# EAGLE design Remote (EAGLE 5.11)
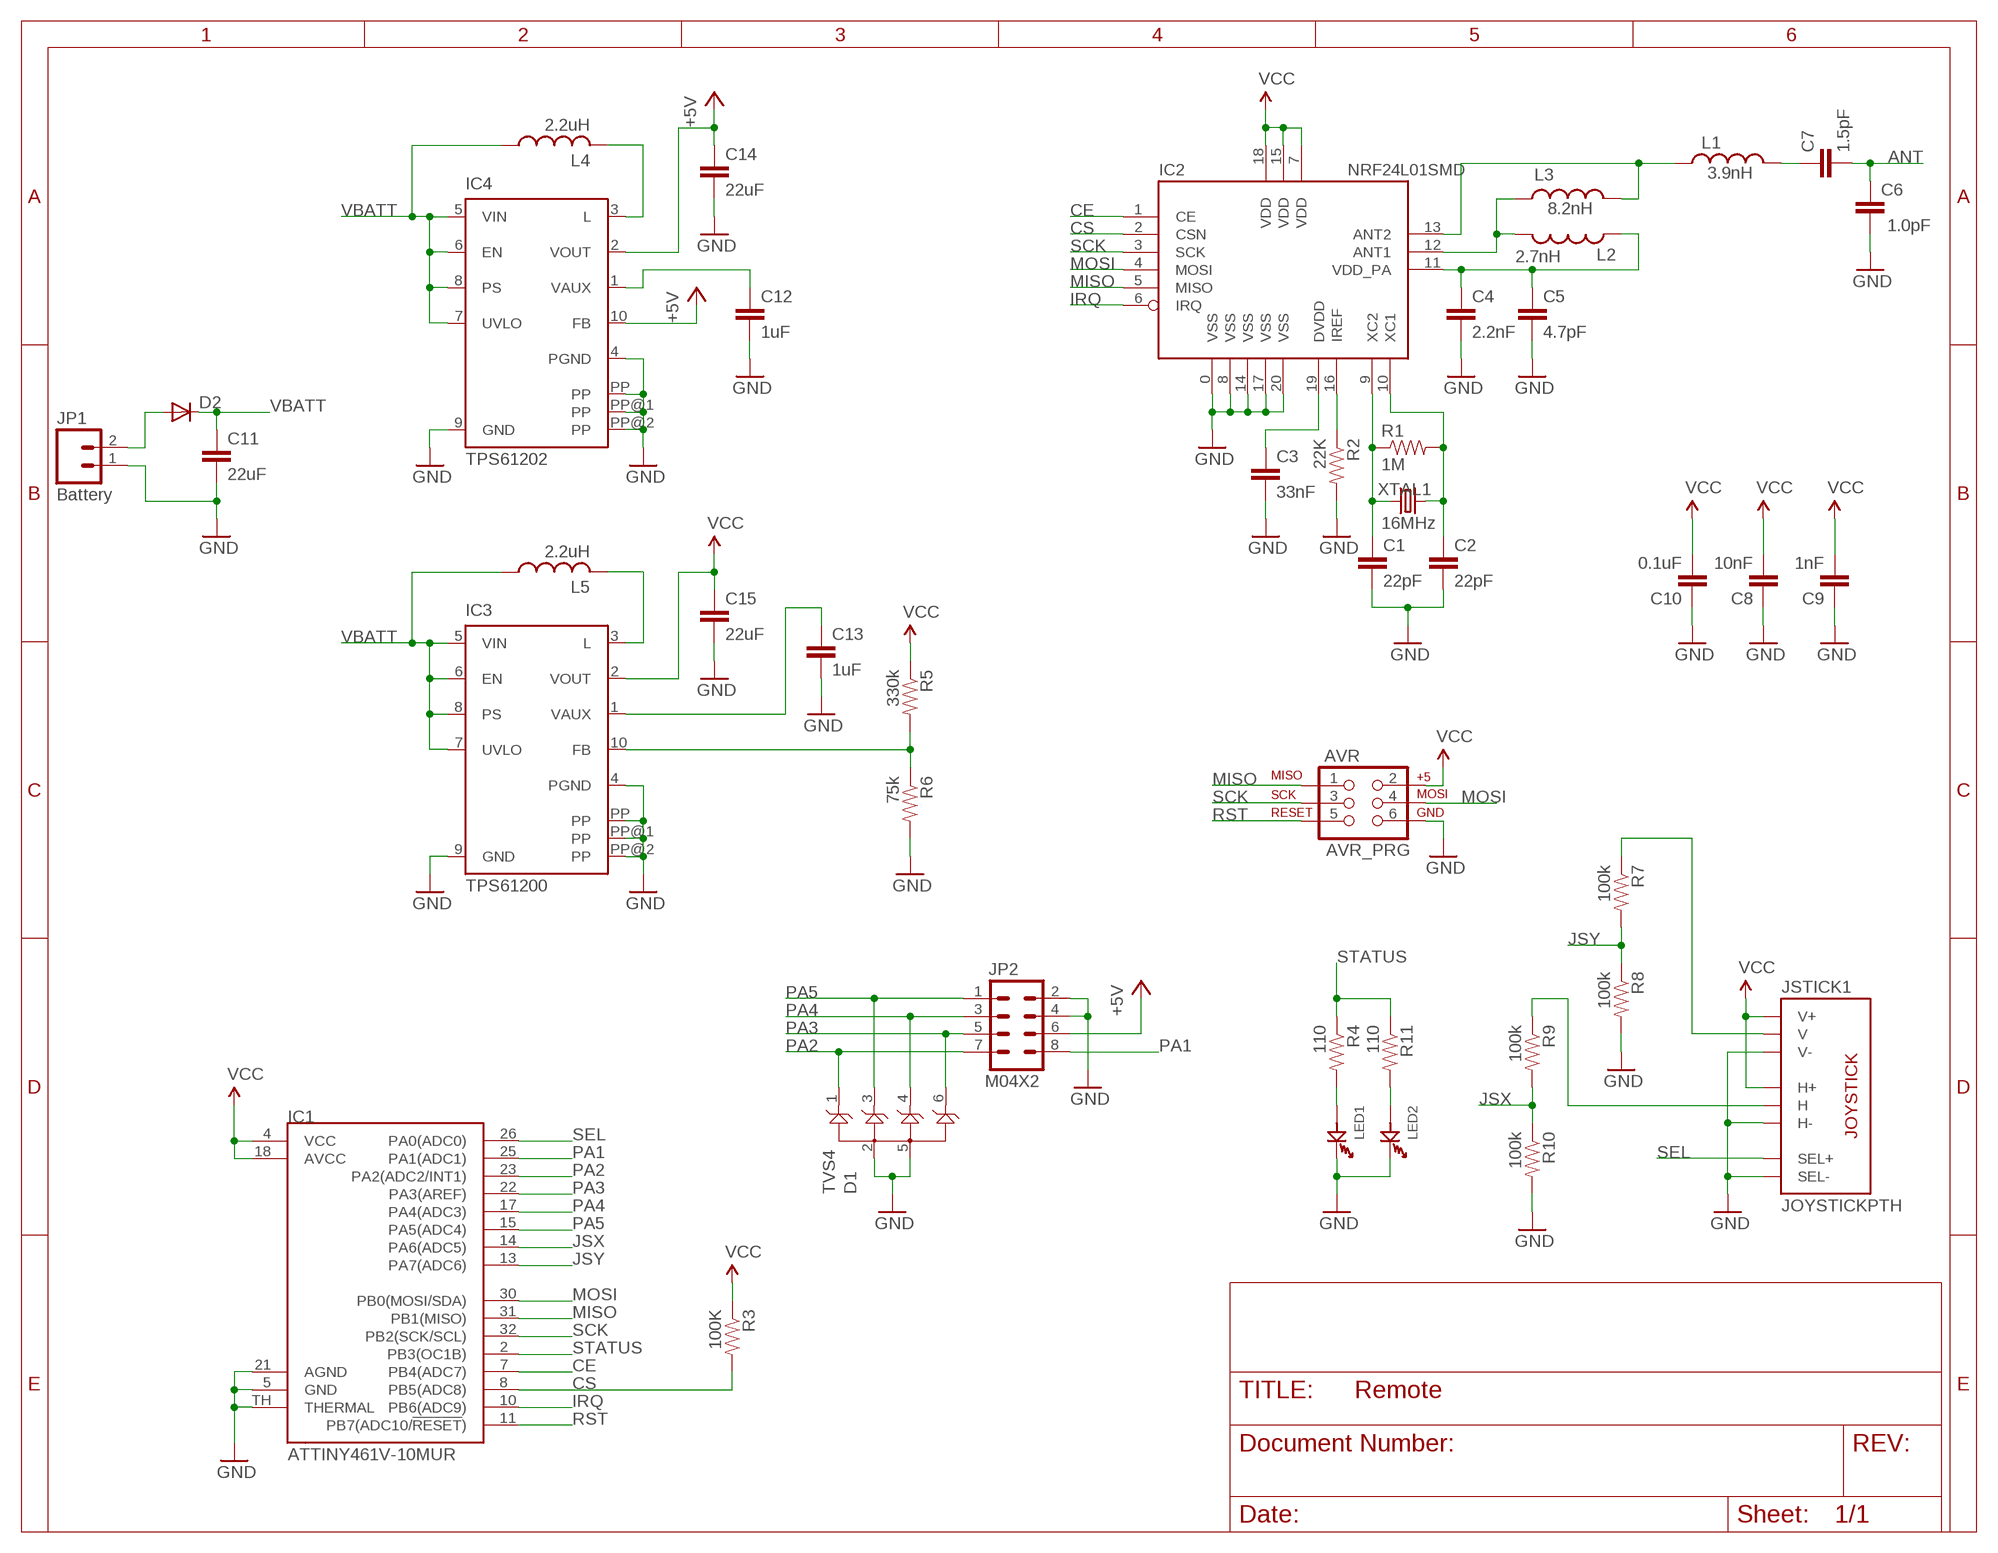
[diagram p0: schematic, sheet 1]

## Parts
AVR  AVR_PRG  AVR_SPI_PRG_6PTH  [2X3]
C1  22pF  CAP0402  [C0402]
C2  22pF  CAP0402  [C0402]
C3  33nF  CAP0402  [C0402]
C4  2.2nF  CAP0402  [C0402]
C5  4.7pF  CAP0402  [C0402]
C6  1.0pF  CAP0402  [C0402]
C7  1.5pF  CAP0402  [C0402]
C8  10nF  CAP0402  [C0402]
C9  1nF  CAP0402  [C0402]
C10  0.1uF  CAP0402  [C0402]
C11  22uF  C-EUC0603  [C0603]
C12  1uF  CAP0402  [C0402]
C13  1uF  CAP0402  [C0402]
C14  22uF  C-EUC0603  [C0603]
C15  22uF  C-EUC0603  [C0603]
D1  TVS4  [SC89]
D2  DIODE-SOD123  [SOD123]
IC1  ATTINY461V-10MUR  [MLF32-TH]
IC2  NRF24L01SMD  [QFN20]
IC3  TPS61200  [S-PDSO-N10]
IC4  TPS61202  [S-PDSO-N10]
JP1  Battery  M02PTH  [1X02]
JP2  M04X2  [2X4]
JSTICK1  JOYSTICKPTH  [JOYSTICK]
L1  3.9nH  INDUCTOR0402  [C0402]
L2  2.7nH  INDUCTOR0402  [C0402]
L3  8.2nH  INDUCTOR0402  [C0402]
L4  2.2uH  L-USL0805  [L0805]
L5  2.2uH  L-USL0805  [L0805]
LED1  CHIPLED  [0603LED]
LED2  CHIPLED  [0603LED]
R1  1M  RESISTOR0402  [C0402]
R2  22K  RESISTOR0402  [C0402]
R3  100K  RESISTOR0402  [C0402]
R4  110  RESISTOR0402  [C0402]
R5  330k  RESISTOR0402  [C0402]
R6  75k  RESISTOR0402  [C0402]
R7  100k  RESISTOR0402  [C0402]
R8  100k  RESISTOR0402  [C0402]
R9  100k  RESISTOR0402  [C0402]
R10  100k  RESISTOR0402  [C0402]
R11  110  RESISTOR0402  [C0402]
XTAL1  16MHz  CRYSTAL5X3  [CRYSTAL-SMD-5X3]

## Nets
+5V: C14.1 IC4.2(VOUT) IC4.10(FB) JP2.6
ANT: C6.2 C7.2
CE: IC1.7(PB4(ADC7)) IC2.1(CE)
CS: IC1.8(PB5(ADC8)) IC2.2(CSN) R3.2
GND: AVR.6 C1.2 C2.2 C3.2 C4.2 C5.2 C6.1 C8.1 C9.1 C10.1 C11.2 C12.2 C13.2 C14.2 C15.2 D1.2(GND) D1.5(GND) IC1.5(GND) IC1.21(AGND) IC1.TH(THERMAL) IC2.0(VSS) IC2.8(VSS) IC2.14(VSS) IC2.17(VSS) IC2.20(VSS) IC3.4(PGND) IC3.9(GND) IC3.PP IC3.PP@1(PP) IC3.PP@2(PP) IC4.4(PGND) IC4.9(GND) IC4.PP IC4.PP@1(PP) IC4.PP@2(PP) JP1.1 JP2.2 JP2.4 JSTICK1.B2A(SEL-) JSTICK1.H3(H-) JSTICK1.V3(V-) LED1.2 LED2.2 R2.2 R6.2 R8.2 R10.2
IRQ: IC1.10(PB6(ADC9)) IC2.6(IRQ)
JSX: IC1.14(PA6(ADC5)) R9.2 R10.1
JSX_HIGH: JSTICK1.H2(H) R9.1
JSY: IC1.13(PA7(ADC6)) R7.2 R8.1
JSY_HIGH: JSTICK1.V2(V) R7.1
MISO: AVR.1 IC1.31(PB1(MISO)) IC2.5(MISO)
MOSI: AVR.4 IC1.30(PB0(MOSI/SDA)) IC2.4(MOSI)
N$1: C1.1 IC2.9(XC2) R1.1 XTAL1.1
N$2: C2.1 IC2.10(XC1) R1.2 XTAL1.3
N$3: IC2.12(ANT1) L2.2 L3.1
N$4: IC2.16(IREF) R2.1
N$5: C3.1 IC2.19(DVDD)
N$6: IC2.13(ANT2) L1.1 L3.2
N$7: C4.1 C5.1 IC2.11(VDD_PA) L2.1
N$8: LED1.1 R4.2
N$9: C7.1 L1.2
N$10: IC3.3(L) L5.2
N$11: IC4.3(L) L4.2
N$12: IC3.10(FB) R5.2 R6.1
N$13: C12.1 IC4.1(VAUX)
N$14: C13.1 IC3.1(VAUX)
N$15: D2.A JP1.2
N$17: LED2.1 R11.2
PA1: IC1.25(PA1(ADC1)) JP2.8
PA2: D1.1 IC1.23(PA2(ADC2/INT1)) JP2.7
PA3: D1.6 IC1.22(PA3(AREF)) JP2.5
PA4: D1.4 IC1.17(PA4(ADC3)) JP2.3
PA5: D1.3 IC1.15(PA5(ADC4)) JP2.1
RST: AVR.5 IC1.11(PB7(ADC10/!RESET!))
SCK: AVR.3 IC1.32(PB2(SCK/SCL)) IC2.3(SCK)
SEL: IC1.26(PA0(ADC0)) JSTICK1.B1A(SEL+)
STATUS: IC1.2(PB3(OC1B)) R4.1 R11.1
VBATT: C11.1 D2.C IC3.5(VIN) IC3.6(EN) IC3.7(UVLO) IC3.8(PS) IC4.5(VIN) IC4.6(EN) IC4.7(UVLO) IC4.8(PS) L4.1 L5.1
VCC: AVR.2 C8.2 C9.2 C10.2 C15.1 IC1.4(VCC) IC1.18(AVCC) IC2.7(VDD) IC2.15(VDD) IC2.18(VDD) IC3.2(VOUT) JSTICK1.H1(H+) JSTICK1.V1(V+) R3.1 R5.1

## Library data of the parts
AVR = SparkFun:AVR_SPI_PRG_6: AVR ISP 6 Pin This is the reduced ISP connector for AVR programming. Common on Arduino. This footprint will take up less PCB space and can be used with a 10-pin to 6-pin adapter such as SKU: BOB-08508
C1-C10 C12 C13 = SparkFun:CAP: Capacitor Standard 0603 ceramic capacitor, and 0.1" leaded capacitor.
C11 C14 C15 = rcl:C-EU: CAPACITOR, European symbol
D1 = vanossj:TVS4
D2 = diode:DIODE-: DIODE
IC1 = PAS:ATTINY461V-10MUR: ATtiny26
IC2 = SparkFun:NRF24L01: 2.4GHz Low Power Transceiver This is the very popular, low cost, very low power RF transceiver from Nordic Semiconductor. Simple SPI interface. SKU: COM-00690
IC3 = texas:TPS6120*: LOW INPUT VOLTAGE SYNCHRONOUS BOOST CONVERTER WITH 1.3-A SWITCHES Source: http://focus.ti.com/lit/ds/symlink/tps61200.pdf; MPN: TPS61200DRCT; OC_FARNELL: 1471238; OC_NEWARK: 37M0066
IC4 = texas:TPS6120*: LOW INPUT VOLTAGE SYNCHRONOUS BOOST CONVERTER WITH 1.3-A SWITCHES Source: http://focus.ti.com/lit/ds/symlink/tps61200.pdf; MPN: TPS61202DRCR; OC_FARNELL: unknown; OC_NEWARK: 37M0069
JP1 = SparkFun:M02: Header 2 Standard 2-pin 0.1" header. Use with straight break away headers (SKU : PRT-00116), right angle break away headers (PRT-00553), swiss pins (PRT-00743), machine pins (PRT-00117), and female headers (PRT-00115). Molex polarized connector foot print use with SKU : PRT-08233 with associated crimp pins and housings.
JP2 = SparkFun:M04X2
JSTICK1 = SparkFun:JOYSTICK: Thumb Joystick Joystick commonly found in PS2 controllers. Two pots and a select switch. Footprint proven. Spark Fun Electronics SKU : COM-09032
L1-L3 = SparkFun:INDUCTOR: Inductors Basic Inductor/Choke - 0603 and 1206. Footprints are not proven and vary greatly between part numbers.
L4 L5 = L0805:L-US: INDUCTOR, American symbol
LED1 LED2 = PAS:CHIPLED
R1-R11 = SparkFun:RESISTOR: Resistor Basic schematic elements and footprints for 0603, 1206, and PTH 1/10th watt (small) resistors.
XTAL1 = SparkFun:CRYSTAL: Crystals Various standard crystals. Proven footprints. Spark Fun Electronics SKU : COM-00534

## Board
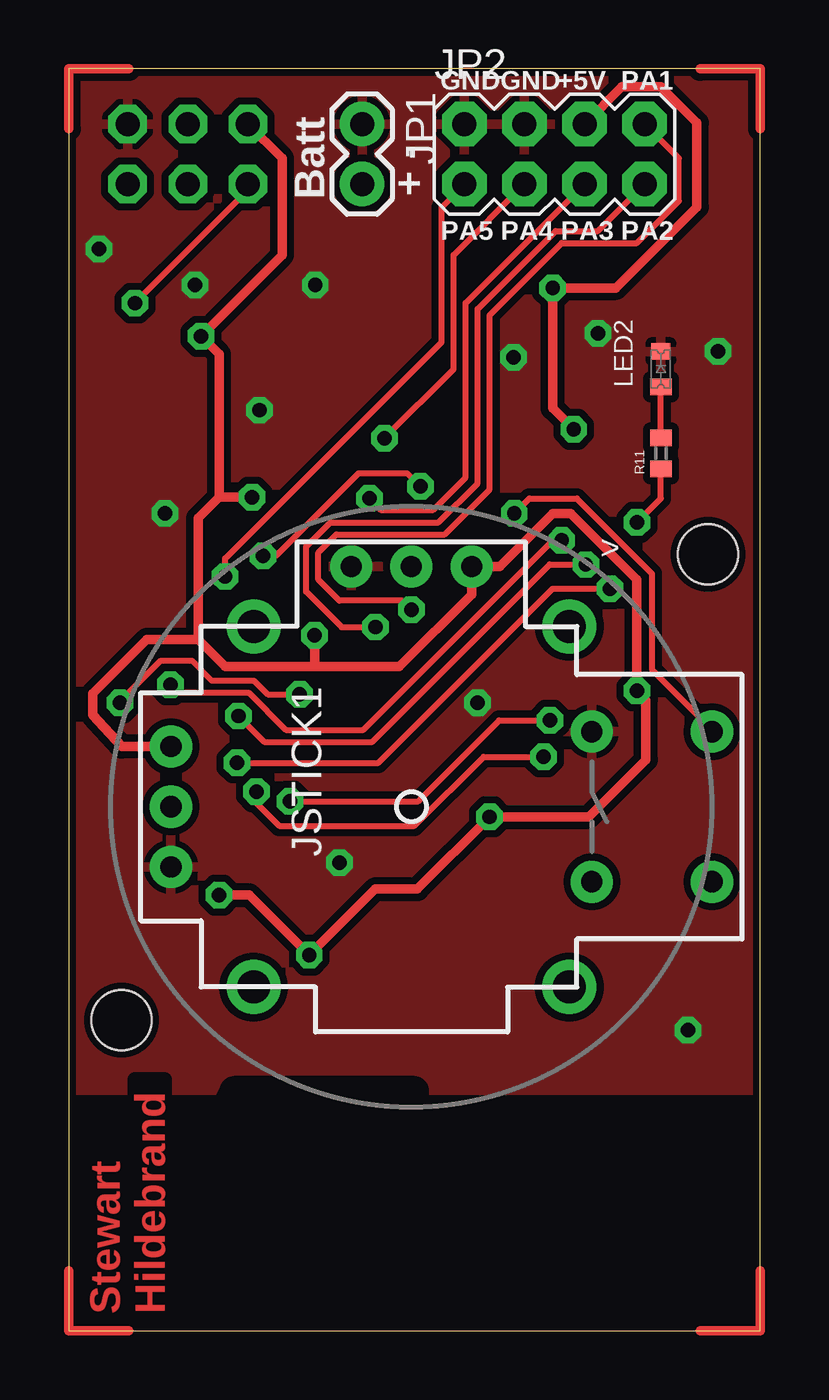
[diagram p1: board, top side]
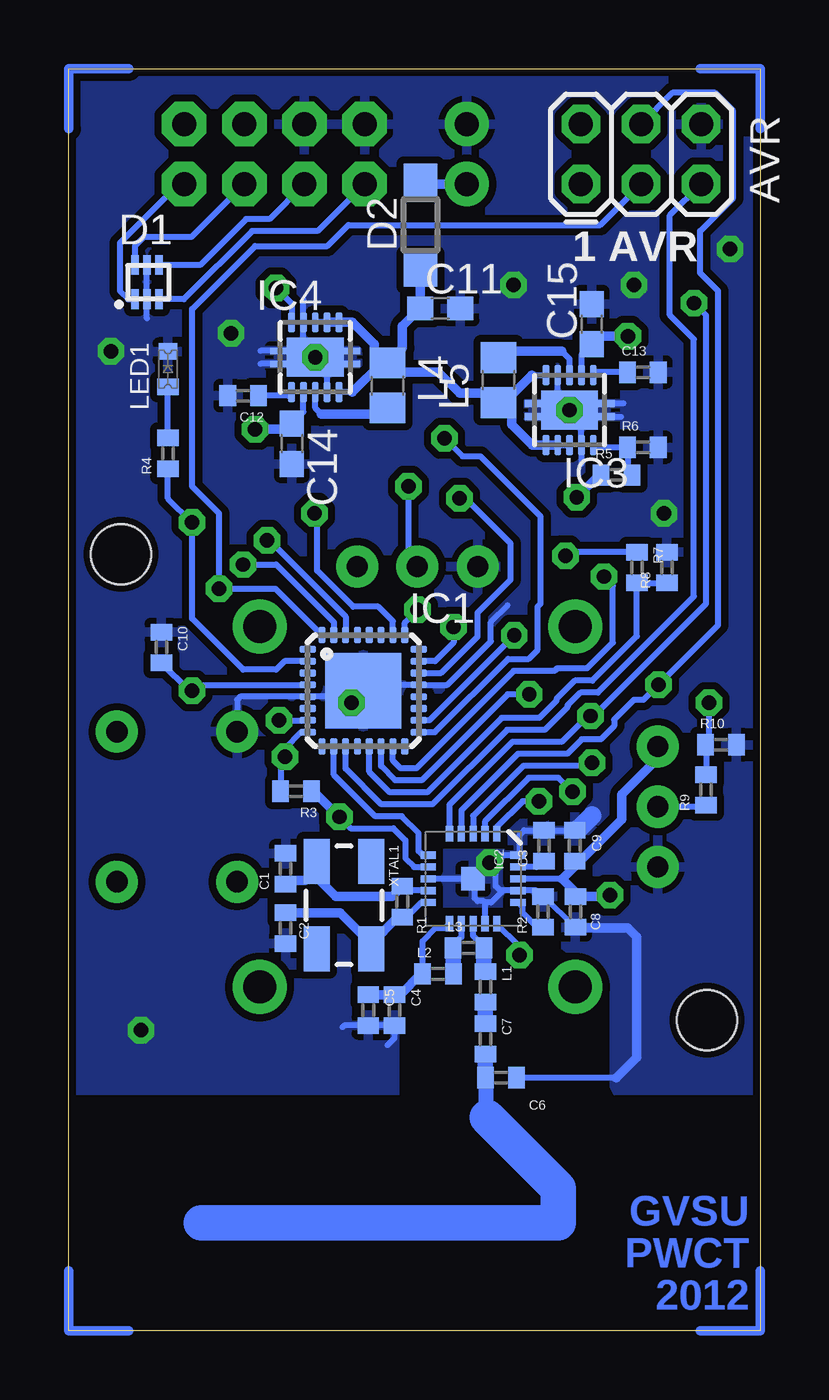
[diagram p2: board, bottom side, seen from below]

Size 29.21 x 53.34 mm. Coordinates in mm from the lower left corner, seen from the top.
Outline: 29.21,0 29.21,53.34 0,53.34 0,0 29.21,0
Copper layers (1*16): Top 0.035mm / dielectric 1.5mm / Bottom 0.035mm
Design rules "SparkFun *": minimum track width 8mil, minimum drill 20mil, track to track 10mil, track to pad 12mil, pad to pad 12mil, via to via 12mil, smd to smd 10mil, copper to edge 10mil, drill to drill 8mil, minimum pad ring 12mil, minimum via ring 10mil, stop-mask expansion 4mil, vias tented up to drill 0mil, thermal gap 10mil
Holes 2.54 mm at 27,32.82 2.24,13.13
tRestrict: area 5.7,1.5 to 25,10.2
bRestrict: area 5.7,1.5 to 25,17.3

### Footprints (pad centres in the part's own frame; a part is rotated, then mirrored left to right if it is on the bottom)
2X3 = drill 1.016 octagon: 1 0,0; 2 0,2.54; 3 2.54,0; 4 2.54,2.54; 5 5.08,0; 6 5.08,2.54
C0402 = smd 0.7 x 0.9: 1 -0.65,0; 2 0.65,0
C0603 = smd 1.1 x 1: 1 -0.85,0; 2 0.85,0
SC89 = smd 0.305 x 0.838: 1 -0.508,-0.724; 2 0,-0.724; 3 0.508,-0.724; 4 0.508,0.724; 5 0,0.724; 6 -0.508,0.724
SOD123 = smd 1.4 x 1.4: A 1.9,0; C -1.9,0
MLF32-TH = smd 0.7 x 0.3: 1 -2.35,1.75; 2 -2.35,1.25; 3 -2.35,0.75; 4 -2.35,0.25; 5 -2.35,-0.25; 6 -2.35,-0.75; 7 -2.35,-1.25; 8 -2.35,-1.75; 17 2.35,-1.75; 18 2.35,-1.25; 19 2.35,-0.75; 20 2.35,-0.25; 21 2.35,0.25; 22 2.35,0.75; 23 2.35,1.25; 24 2.35,1.75 | smd 0.3 x 0.7: 9 -1.75,-2.35; 10 -1.25,-2.35; 11 -0.75,-2.35; 12 -0.25,-2.35; 13 0.25,-2.35; 14 0.75,-2.35; 15 1.25,-2.35; 16 1.75,-2.35; 25 1.75,2.35; 26 1.25,2.35; 27 0.75,2.35; 28 0.25,2.35; 29 -0.25,2.35; 30 -0.75,2.35; 31 -1.25,2.35; 32 -1.75,2.35 | smd 3.2 x 3.2: TH 0,0
QFN20 = smd 1 x 1: 0 0,0 | smd 0.65 x 0.3: 1 -1.9,1; 2 -1.9,0.5; 3 -1.9,0; 4 -1.9,-0.5; 5 -1.9,-1; 11 1.9,-1; 12 1.9,-0.5; 13 1.9,0; 14 1.9,0.5; 15 1.9,1 | smd 0.3 x 0.65: 6 -1,-1.9; 7 -0.5,-1.9; 8 0,-1.9; 9 0.5,-1.9; 10 1,-1.9; 16 1,1.9; 17 0.5,1.9; 18 0,1.9; 19 -0.5,1.9; 20 -1,1.9
S-PDSO-N10 = smd 0.28 x 0.85: 1 -1,-1.475; 2 -0.5,-1.475; 3 0,-1.475; 4 0.5,-1.475; 5 1,-1.475; 6 1,1.475; 7 0.5,1.475; 8 0,1.475; 9 -0.5,1.475; 10 -1,1.475 | smd 2.4 x 1.65: PP 0,0 | smd 3.8 x 0.28: PP@1 0,0.275; PP@2 0,-0.275
1X02 = drill 1.016 pad 1.88 round: 1 0,0; 2 2.54,0
2X4 = drill 1.016 pad 1.88 octagon: 1 -3.81,-1.27; 2 -3.81,1.27; 3 -1.27,-1.27; 4 -1.27,1.27; 5 1.27,-1.27; 6 1.27,1.27; 7 3.81,-1.27; 8 3.81,1.27
JOYSTICK = drill 0.9 pad 1.778 round: B1A -3.175,12.7; B1B 3.175,12.7; B2A -3.175,7.62; B2B 3.175,7.62 | drill 0.889 pad 1.778 round: H1 -2.54,-10.16; H2 0,-10.16; H3 2.54,-10.16; V1 -10.16,2.54; V2 -10.16,0; V3 -10.16,-2.54 | drill 1.397 pad 2.286 round: MOUNT1 -7.62,6.668; MOUNT2 -7.62,-6.668; MOUNT3 7.62,-6.668; MOUNT4 7.62,6.668
L0805 = smd 1.3 x 1.5: 1 -0.95,0; 2 0.95,0
0603LED = smd 0.9 x 0.7: 1 0,0.75 | smd 0.8 x 0.7: 2 0,-0.75
CRYSTAL-SMD-5X3 = smd 1.9 x 1.1: 1 -1.85,-1.15; 2 1.85,-1.15; 3 1.85,1.15; 4 -1.85,1.15

### Placement (x,y rotation side)
AVR  7.57,48.46 0 bottom
C1  20.05,19.53 90 bottom
C2  20.05,17.02 270 bottom
C3  9.13,20.5 90 bottom
C4  15.44,13.55 270 bottom
C5  16.56,13.55 270 bottom
C6  10.95,10.69 180 bottom
C7  11.61,12.33 270 bottom
C8  7.81,17.7 90 bottom
C9  7.83,20.5 270 bottom
C10  25.3,28.88 270 bottom
C11  13.51,43.21 0 bottom
C12  21.84,39.52 180 bottom
C13  4.95,40.51 0 bottom
C14  19.79,37.49 270 bottom
C15  7.11,42.55 90 bottom
D1  25.91,44.32 0 bottom
D2  14.35,46.74 90 bottom
IC1  16.76,27.05 0 bottom
IC2  12.12,19.1 270 bottom
IC3  8.05,38.91 180 bottom
IC4  18.8,41.15 0 bottom
JP1  12.4,51 270 top
JP2  20.52,49.73 0 top
JSTICK1  14.48,22.15 270 top
L1  11.61,14.53 270 bottom
L2  13.61,15.08 0 bottom
L3  12.32,16.18 0 bottom
L4  15.75,39.95 270 bottom
L5  11.05,40.18 90 bottom
LED1  25.02,40.64 180 bottom
LED2  25.02,40.64 180 top
R1  15.12,18.14 270 bottom
R2  9.18,17.7 90 bottom
R3  19.61,22.81 180 bottom
R4  25.02,37.08 90 bottom
R5  6.07,36.17 0 bottom
R6  4.95,37.34 0 bottom
R7  5.21,32.26 270 bottom
R8  3.94,32.26 90 bottom
R9  2.29,22.86 90 bottom
R10  1.65,24.77 0 bottom
R11  25.02,37.08 90 top
XTAL1  17.59,17.98 270 bottom

### Tracks (layer width: path | path; a pad name or v marks a point on that pad's centre or on a via)
+5V  (via drill 0.61)
  Top 0.406: v21.34,38.1 20.45,38.99 v20.45,44.07 23.11,44.07 26.54,47.5 26.54,51.05 25.02,52.58 23.37,52.58 JP2.6
  Bottom 0.254: IC4.2 19.3,38.83 C14.1 20.03,38.1 | IC4.10 19.8,43.42 v20.45,44.07
  Bottom 0.406: 20.03,38.1 v21.34,38.1
ANT
  Bottom 0.254: 11.56,10.55 11.56,10.66 C6.2
  Bottom 0.635: 11.52,9.02 11.52,9.37 11.56,9.41 11.56,10.55
  Bottom 0.66: C7.2 11.61,10.7 C6.2
  Bottom 1.5: 11.52,9.02 8.52,6.02 8.52,4.56 23.61,4.56
BEDGE1
  Bottom 0.406: 0,2.54 0,0 2.54,0
BEDGE2
  Bottom 0.406: 2.54,53.34 0,53.34 0,50.8
BEDGE3
  Bottom 0.406: 26.67,53.34 29.21,53.34 29.21,50.8
BEDGE4
  Bottom 0.406: 26.67,0 29.21,0 29.21,2.54
CE  (via drill 0.61)
  Top 0.254: v9.35,22.38 14.76,22.38 18.18,25.8 v20.32,25.8
  Bottom 0.254: IC2.1 11.12,21.29 10.03,22.38 v9.35,22.38 | v20.32,25.8 IC1.7
CS  (via drill 0.61)
  Top 0.254: v7.92,22.78 7.92,22.3 8.89,21.34 14.61,21.34 17.53,24.26 v20.07,24.26
  Bottom 0.254: IC2.2 11.62,21.52 9.78,23.37 8.51,23.37 v7.92,22.78 | R3.2 20.26,24.06 v20.07,24.26 20.07,24.64 19.4,25.3 IC1.8
GND  (via drill 0.61)
  Bottom 0.203: 7.8,17.02 9.13,18.35 R2.2
  Bottom 0.254: 11.62,18.1 IC2.14 | 11.62,18.1 11.68,18.16 11.94,18.16 12.06,18.29 12.06,19.04 IC2.0 IC2.8 | IC2.17 10.86,18.6 11.36,18.1 11.62,18.1 | 17.65,12.83 17.58,12.9 C4.2 15.44,12.37 15.75,12.06 | 6.07,10.69 C6.1 | 7.55,36.63 IC3.9 7.55,38.14 IC3.PP@1 5.87,38.64 | IC2.17 10.98,18.6 11.18,18.8 11.18,19.53 v11.43,19.79 11.33,19.79 11.01,20.1 IC2.20 10.16,20.16 10.16,20.95 9.97,21.15 C3.2 C9.1 7.73,21.15 7.67,21.21 | IC2.17 9.45,18.6 9.2,18.35 R2.2 | JSTICK1.B2A 22.1,26.67 21.97,26.8 IC1.5 17.01,26.8 IC1.TH 16.51,27.3 IC1.21 13.21,27.3 11.38,29.13 11.38,29.95 10.67,30.66 | 5.77,39.19 IC3.PP@2 8.55,39.69 IC3.4 | D1.5 D1.2 25.91,42.8 | 21.1,40.87 IC4.PP@2 18.3,40.37 IC4.4 | 21.1,41.42 IC4.PP@1 19.3,41.92 IC4.9 19.3,43.57
  Bottom 0.406: 6.07,10.69 5.21,11.56 5.21,16.64 5.59,17.02 7.8,17.02
  Bottom 0.813: 7.67,21.21 7.11,21.77
  other vias: 17.27,26.54 8.05,38.91 18.8,41.15 26.16,12.7 4.06,34.54 10.41,44.2 22.35,42.16 27.43,41.4 1.27,45.72 5.33,44.2
  pour Top (isolate 0.305): -1.27,10.16 30.48,10.16 30.48,54.61 -1.27,54.61
  pour Bottom (isolate 0.305): -1.27,10.16 30.48,10.16 30.48,54.61 -1.27,54.61
IRQ
  Bottom 0.254: IC2.6 14.26,20.1 14.43,20.27 14.43,21.03 15.14,21.74 16.26,21.74 18.01,23.5 IC1.10
JSX  (via drill 0.61)
  Top 0.254: v9.75,26.9 8.41,26.9 7.82,27.48 6.04,27.48 5.21,28.32 3.89,28.32 2.16,26.59 v2.16,26.54
  Bottom 0.254: IC1.14 16.01,23.86 15.42,23.27 14.3,23.27 10.67,26.9 v9.75,26.9 | R9.2 2.29,24.75 R10.1 2.16,24.91 v2.16,26.54
JSX_HIGH
  Bottom 0.254: JSTICK1.H2 2.35,22.15 R9.1
JSY
  Bottom 0.254: IC1.13 16.51,23.63 15.65,22.76 14.07,22.76 10.92,25.91 9.32,25.91 8.61,26.62 8.61,26.7 7.82,27.48 7.09,27.48 5.21,29.36 R7.2 R8.1
JSY_HIGH  (via drill 0.61)
  Top 0.254: v14.86,35.69 14.3,36.25 12.24,36.25 8.75,32.75 v8.21,32.75
  Bottom 0.254: v14.86,35.69 14.86,32.69 JSTICK1.V2 | R7.1 8.06,32.91 v8.21,32.75
MISO  (via drill 0.61)
  Top 0.254: v7.16,25.98 8.26,24.89 12.83,24.89 20.32,32.38 v21.84,32.38 | v2.79,43.43 7.57,48.21 AVR.1
  Bottom 0.254: IC2.5 13.12,22.23 10.46,24.89 8.38,24.89 7.29,25.98 v7.16,25.98 7.04,25.98 2.29,30.73 2.29,42.93 v2.79,43.43 | IC1.31 18.01,29.95 20.45,32.38 v21.84,32.38
MOSI  (via drill 0.61)
  Top 0.254: v4.29,27.3 4.62,26.98 7.59,26.98 9.17,25.4 12.45,25.4 20.45,33.4 v20.83,33.4
  Bottom 0.254: IC2.4 12.62,22 10.24,24.38 8.15,24.38 7.54,24.99 6.73,24.99 6.17,25.55 6.17,25.83 5.33,26.67 4.93,26.67 v4.29,27.3 1.78,29.82 1.78,43.94 2.54,44.7 2.54,46.48 1.14,47.88 1.14,51.56 1.91,52.32 3.71,52.32 AVR.4 | IC1.30 17.51,30.19 20.73,33.4 v20.83,33.4
N$1
  Bottom 0.254: IC2.9 14.94,18.6 R1.1
  Bottom 0.406: R1.1 15.54,18.36 17.93,18.36 18.73,19.17 XTAL1.1 18.73,19.52 19.23,19.02 19.91,19.02 C1.1
N$2
  Bottom 0.254: IC2.10 14.31,18.1 14.93,17.49 R1.2
  Bottom 0.406: R1.2 15.31,17.49 16.43,16.36 | 16.43,16.36 XTAL1.3 | 16.43,16.36 17.73,17.65 20.03,17.65 C2.1
N$3
  Bottom 0.254: IC2.12 12.62,16.64 12.97,16.29 L3.1
  Bottom 0.66: L3.1 12.97,15.1 L2.2
N$4
  Bottom 0.254: R2.1 9.43,17.05 10.03,17.65 10.03,17.91 IC2.16
N$5
  Bottom 0.254: IC2.19 9.45,19.6 C3.1
N$6
  Bottom 0.254: IC2.13 12.12,16.7 11.67,16.25 L3.2
  Bottom 0.66: L3.2 11.67,15.25 L1.1
N$7
  Bottom 0.254: 14.33,15.08 L2.1 14.26,16.48 13.72,17.02 13.31,17.02 IC2.11 | 15.21,14.2 C4.1
  Bottom 0.406: C4.1 C5.1 | 14.33,15.08 15.21,14.2
N$8
  Bottom 0.254: R4.2 LED1.1
N$9
  Bottom 0.66: L1.2 C7.1
N$10
  Bottom 0.254: IC3.3 8.05,41.07 8.38,41.4 | 10.73,41.4 L5.2
  Bottom 0.406: 8.38,41.4 10.73,41.4
N$11
  Bottom 0.254: IC4.3 18.8,38.99 18.54,38.73 | L4.2 16.07,38.73
  Bottom 0.406: 16.07,38.73 18.54,38.73
N$12
  Bottom 0.254: IC3.10 6.95,37.34 R6.1 5.6,36.35 R5.2
N$13
  Bottom 0.254: IC4.1 19.95,39.52 C12.1
N$14
  Bottom 0.254: IC3.1 6.93,40.51 C13.1
N$15
  Bottom 0.406: JP1.2 14.18,48.46 D2.A
N$17
  Top 0.254: R11.2 LED2.1
PA1  (via drill 0.61)
  Top 0.254: v14.48,30.48 14.1,30.86 11.43,30.86 10.54,31.75 10.54,32.89 11.3,33.66 15.88,33.66 17.78,35.56 17.78,42.93 20.83,45.97 24,45.97 25.78,47.75 25.78,49.55 JP2.8
  Bottom 0.254: IC1.25 15.01,29.94 v14.48,30.48
PA2  (via drill 0.61)
  Top 0.254: v12.95,29.74 11.53,29.74 10.03,31.24 10.03,33.15 11.05,34.16 15.62,34.16 17.27,35.81 17.27,43.18 20.57,46.48 22.35,46.48 JP2.7
  Bottom 0.254: IC1.23 13.74,28.3 12.95,29.08 v12.95,29.74 | D1.1 26.71,43.6 27.05,43.94 27.05,45.97 24.56,48.46 JP2.7
PA3  (via drill 0.61)
  Top 0.254: v12.7,35.18 13.18,34.7 15.39,34.7 16.76,36.07 16.76,43.43 JP2.5
  Bottom 0.254: IC1.22 13.47,27.8 11.94,29.34 11.94,30.35 10.54,31.75 10.54,33.27 12.45,35.18 v12.7,35.18 | D1.6 26.42,45.85 26.04,46.23 24.03,46.23 JP2.5
PA4  (via drill 0.61)
  Top 0.254: v13.34,37.72 16.26,40.64 16.26,45.47 JP2.3
  Bottom 0.254: IC1.17 13.74,25.3 10.65,28.4 9.78,28.4 9.4,28.78 9.4,30.61 9.27,30.73 9.27,34.42 11.81,36.96 12.57,36.96 v13.34,37.72 | JP2.3 20.73,46.99 21.72,46.99 23.66,45.05 D1.4
PA5  (via drill 0.61)
  Top 0.254: v6.6,31.88 6.6,32.64 15.75,41.78 15.75,47.5 JP2.1
  Bottom 0.254: IC1.15 15.51,24.1 15.19,23.77 14.53,23.77 10.41,27.89 8.69,27.89 8.59,27.99 7.32,27.99 6.22,29.08 6.22,31.5 v6.6,31.88 | JP2.1 18.69,46.48 21.46,46.48 24.35,43.6 D1.3
RST
  Bottom 0.254: IC1.11 17.51,23.76 16,22.25 13.84,22.25 10.69,25.4 9.09,25.4 8.13,26.36 8.13,26.44 7.59,26.98 6.86,26.98 2.79,31.04 2.79,41.91 3.81,42.93 3.81,47.14 AVR.5
SCK  (via drill 0.61)
  Top 0.254: v7.11,24 13.08,24 20.45,31.37 v22.86,31.37
  Bottom 0.254: IC2.3 12.12,21.76 10.01,23.88 7.24,23.88 v7.11,24 | IC1.32 20.48,31.37 v22.86,31.37 22.86,34.54 24,35.69 24,43.18 21.34,45.85 18.29,45.85 17.4,46.74 6.76,46.74 AVR.3
SEL  (via drill 0.61)
  Top 0.254: v18.82,34.54 19.46,35.18 21.46,35.18 24.64,32 24.64,27.94 27.18,25.4 JSTICK1.B1A
  Bottom 0.254: IC1.26 15.51,29.99 16.13,30.61 17.2,30.61 18.72,32.13 18.72,34.44 v18.82,34.54
STATUS  (via drill 0.61)
  Top 0.254: v24,34.16 25.02,35.18 R11.1
  Bottom 0.254: IC1.2 20.09,28.3 20.45,27.94 21.84,27.94 24,30.1 v24,34.16 25.02,35.18 R11.1
TEDGE1
  Top 0.406: 0,2.54 0,0 2.54,0
TEDGE2
  Top 0.406: 0,50.8 0,53.34 2.54,53.34
TEDGE3
  Top 0.406: 26.67,53.34 29.21,53.34 29.21,50.8
TEDGE4
  Top 0.406: 26.67,0 29.21,0 29.21,2.54
VBATT
  Bottom 0.254: IC3.7 IC3.8 | IC4.7 IC4.8 | 9.65,40.39 IC3.5 | 17.22,39.67 IC4.5
  Bottom 0.406: IC3.7 IC3.6 9.62,37.44 10.49,38.3 10.49,38.67 L5.1 | IC4.7 IC4.6 17.22,42.62 16.31,41.71 16.31,41.46 L4.1 | 9.65,40.39 10.8,39.23 L5.1 | 17.22,39.67 15.99,40.9 L4.1 | L4.1 15.11,41.54 15.11,42.45 C11.1 14.36,44.82 D2.C | L5.1 11.44,39.62 12.7,39.62 13.59,40.51 15.36,40.51 L4.1
VCC  (via drill 0.61)
  Top 0.406: v6.35,18.41 7.62,18.41 v10.16,15.88 12.95,18.67 14.73,18.67 v17.78,21.72 21.97,21.72 24.38,24.13 24.38,26.67 v24,27.05 24,31.75 21.21,34.54 20.45,34.54 18.21,32.31 JSTICK1.V1 17.02,31.11 13.97,28.07 10.39,28.07 | JSTICK1.H1 2.23,24.69 1.02,26.04 1.02,26.92 3.3,29.21 5.46,29.21 | 5.46,29.21 6.6,28.07 10.39,28.07 | 6.35,35.23 6.35,41.27 v5.59,42.04 9.02,45.47 9.02,49.55 AVR.2 | 6.35,35.23 v7.75,35.23 | 10.39,28.07 v10.39,29.39 | 5.46,29.21 5.46,34.34 6.35,35.23
  Bottom 0.254: 8.36,19.1 IC2.18 | 7.83,19.63 C9.2 7.61,19.85 | C8.2 7.81,18.55 | IC2.7 14.62,19.6 14.99,19.96 14.99,20.73 15.49,21.23 17.3,21.23 v17.78,21.72 | IC1.18 13.97,25.8 v10.39,29.39 | IC2.15 10.16,16.24 v10.16,15.88 | C10.2 24.12,27.05 v24,27.05 23.75,27.3 IC1.4 | IC3.2 7.55,41.26 C15.1
  Bottom 0.406: 7.83,19.63 8.36,19.1 7.81,18.55 | 7.61,19.85 5.84,21.61 5.84,22.66 4.32,24.18 JSTICK1.H1 | v6.35,18.41 6.41,18.35 C8.2 | v17.78,21.72 18.87,22.81 R3.1 | v5.59,42.04 6.77,42.04 C15.1 | v7.75,35.23 6.81,36.17 R5.1

### Text on the board
Top: Stewart | Hildebrand
Bottom: GVSU | PWCT | 2012
tPlace: GND | GND | +5V | PA1 | Batt | + - | PA5 | PA4 | PA3 | PA2
bPlace: 1 AVR
tNames: >
bDocu: B1